# Altium project PHI_GATEWAY.PrjPcb (part 1 of 2)
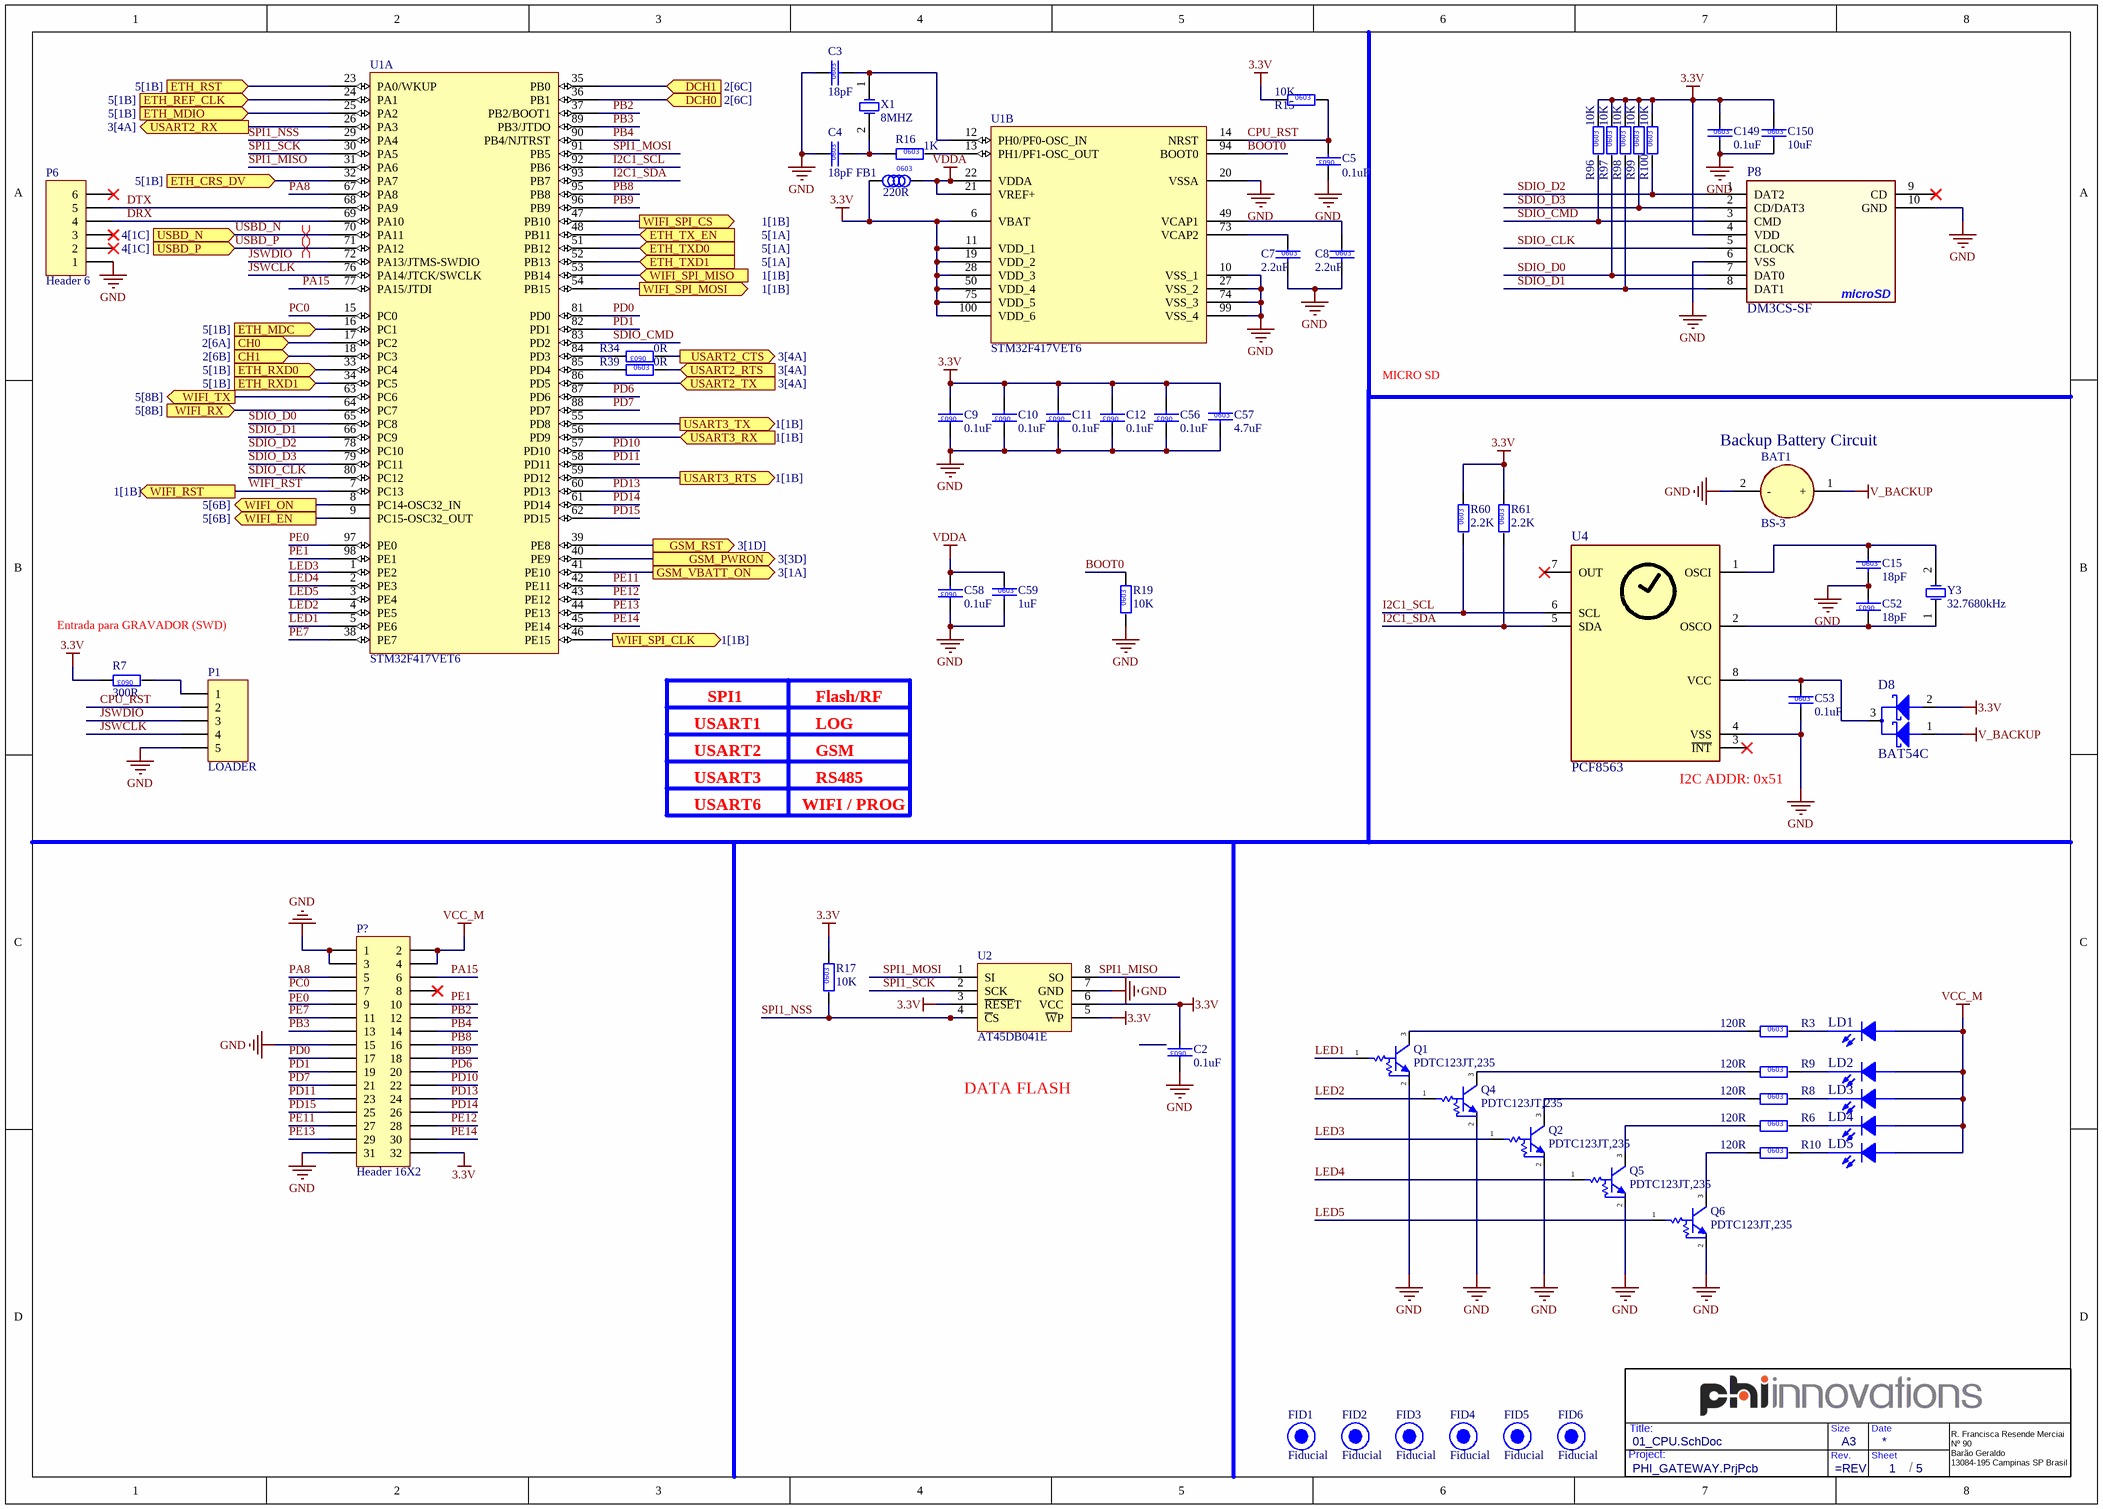
[diagram p0: 01_CPU.SchDoc]
6 sheets, 222 parts. Net scope: flat (ports and power ports of the same name join across sheets).
Board file: PHI_GATEWAY.PcbDoc
Sheets:
  01_CPU.SchDoc
  02_INPUTS.SchDoc
  03_GPRS.SchDoc
  04_POWER_USB.SchDoc
  05_ETHERNET.SchDoc
  VERSIONS.SchDoc

## Sheet 01_CPU.SchDoc
size A3; DocumentNumber: 1; SheetNumber: 1; SheetTotal: 5

### Parts
(Parts that share a designator on the sheet are numbered #1, #2 ... from top to bottom, then left to right.)
?#1  (no value)  (graphical)
BAT1  BS-3  [BAT_BS-3]
C2  0.1uF  [0603C]
C3  18pF  [0603C]
C4  18pF  [0603C]
C5  0.1uF  [0603C]
C7  2.2uF  [0603C]
C8  2.2uF  [0603C]
C9  0.1uF  [0603C]
C10  0.1uF  [0603C]
C11  0.1uF  [0603C]
C12  0.1uF  [0603C]
C15  18pF  [0603C]
C52  18pF  [0603C]
C53  0.1uF  [0603C]
C56  0.1uF  [0603C]
C57  4.7uF  [0603C]
C58  0.1uF  [0603C]
C59  1uF  [0603C]
C149  0.1uF  [0603C]
C150  10uF  [0603C]
D8  BAT54C  [SOT-23-3]
FB1  220R  [0603L]
FID1  Fiducial  [Fiducial Top]  (no BOM)
FID2  Fiducial  [Fiducial Top]  (no BOM)
FID3  Fiducial  [Fiducial Top]  (no BOM)
FID4  Fiducial  [Fiducial Top]  (no BOM)
FID5  Fiducial  [Fiducial Top]  (no BOM)
FID6  Fiducial  [Fiducial Top]  (no BOM)
LD1  LTST-S321KGKT  [LED_1208]  (value not drawn)
LD2  LTST-S321KGKT  [LED_1208]  (value not drawn)
LD3  LTST-S321KGKT  [LED_1208]  (value not drawn)
LD4  LTST-S321KGKT  [LED_1208]  (value not drawn)
LD5  LTST-S321KGKT  [LED_1208]  (value not drawn)
P1  LOADER  [HDR1X5]
P6  Header 6  [HDR1X6]
P8  DM3CS-SF  [CONN_DM3SC]
P?  Header 16X2  [HDR2X16]
Q1  PDTC123JT,235  [SOT-23-3]
Q2  PDTC123JT,235  [SOT-23-3]
Q4  PDTC123JT,235  [SOT-23-3]
Q5  PDTC123JT,235  [SOT-23-3]
Q6  PDTC123JT,235  [SOT-23-3]
R3  120R  [0603R]
R6  120R  [0603R]
R7  300R  [0603R]
R8  120R  [0603R]
R9  120R  [0603R]
R10  120R  [0603R]
R15  10K  [0603R]
R16  1K  [0603R]
R17  10K  [0603R]
R19  10K  [0603R]
R34  0R  [0603R]
R39  0R  [0603R]
R60  2.2K  [0603R]
R61  2.2K  [0603R]
R96  10K  [0603R]
R97  10K  [0603R]
R98  10K  [0603R]
R99  10K  [0603R]
R100  10K  [0603R]
U1  STM32F417VET6  [LQFP100]  (parts A,B of 2)
U2  AT45DB041E  [SOIC8]
U4  PCF8563  [SOIC8]
X1  8MHZ  [HC49]
Y3  32.7680kHz  [XTAL_32KHZ]

### Ports
CH0 (in, see 2[6A]), CH1 (in, see 2[6B]), DCH0 (in, see 2[6C]), DCH1 (in, see 2[6C]), ETH_CRS_DV (in, see 5[1B]), ETH_MDC (in, see 5[1B]), ETH_MDIO (in, see 5[1B]), ETH_REF_CLK (in, see 5[1B]), ETH_RST (in, see 5[1B]), ETH_RXD0 (in, see 5[1B]), ETH_RXD1 (in, see 5[1B]), ETH_TX_EN (in, see 5[1A]), ETH_TXD0 (in, see 5[1A]), ETH_TXD1 (in, see 5[1A]), GSM_PWRON (out, see 3[3D]), GSM_RST (out, see 3[1D]), GSM_VBATT_ON (out, see 3[1A]), USART2_CTS (out, see 3[4A]), USART2_RTS (in, see 3[4A]), USART2_RX (out, see 3[4A]), USART2_TX (in, see 3[4A]), USART3_RTS (out, see 1[1B]), USART3_RX (in, see 1[1B]), USART3_TX (out, see 1[1B]), USBD_N (in, see 4[1C]), USBD_P (in, see 4[1C]), WIFI_EN (out, see 5[6B]), WIFI_ON (out, see 5[6B]), WIFI_RST (out, see 1[1B]), WIFI_RX (in, see 5[8B]), WIFI_SPI_CLK (out, see 1[1B]), WIFI_SPI_CS (out, see 1[1B]), WIFI_SPI_MISO (in, see 1[1B]), WIFI_SPI_MOSI (out, see 1[1B]), WIFI_TX (out, see 5[8B])

### Nets
3.3V: C2.2 C9.2 C10.2 C11.2 C12.2 C56.2 C57.1 C149.1 C150.1 D8.2(ANODE2) FB1.1 P8.4(VDD) P?.32 R7.2 R15.1 R17.2 R60.2 R61.2 R96.2 R97.2 R98.2 R99.2 R100.2 U1.6(VBAT) U1.11(VDD_1) U1.19(VDD_2) U1.28(VDD_3) U1.50(VDD_4) U1.75(VDD_5) U1.100(VDD_6) U2.3(~{RESE}T) U2.5(~{W}P) U2.6(VCC)
GND: BAT1.2(-) C2.1 C3.1 C4.1 C5.1 C7.2 C8.2 C9.1 C10.1 C11.1 C12.1 C15.2 C52.2 C53.2 C56.1 C57.2 C58.1 C59.2 C149.2 C150.2 P1.5 P6.1 P8.6(VSS) P8.10(GND) P?.1 P?.3 P?.15 P?.31 Q1.2(E) Q2.2(E) Q4.2(E) Q5.2(E) Q6.2(E) R19.1 U1.10(VSS_1) U1.20(VSSA) U1.27(VSS_2) U1.74(VSS_3) U1.99(VSS_4) U2.7(GND) U4.4(VSS)
V_BACKUP: BAT1.1(+) D8.1(ANODE1)
VCC_M: LD1.A LD2.A LD3.A LD4.A LD5.A P?.2 P?.4
VDDA: C58.2 C59.1 FB1.2 U1.21(VREF+) U1.22(VDDA)
BOOT0: R19.2 U1.94(BOOT0)
CH0: U1.17(PC2) ; port CH0
CH1: U1.18(PC3) ; port CH1
CPU_RST: C5.2 P1.2 R15.2 U1.14(NRST)
DCH0: U1.36(PB1) ; port DCH0
DCH1: U1.35(PB0) ; port DCH1
DRX: P6.4 U1.69(PA10)
DTX: P6.5 U1.68(PA9)
ETH_CRS_DV: U1.32(PA7) ; port ETH_CRS_DV
ETH_MDC: U1.16(PC1) ; port ETH_MDC
ETH_MDIO: U1.25(PA2) ; port ETH_MDIO
ETH_REF_CLK: U1.24(PA1) ; port ETH_REF_CLK
ETH_RST: U1.23(PA0/WKUP) ; port ETH_RST
ETH_RXD0: U1.33(PC4) ; port ETH_RXD0
ETH_RXD1: U1.34(PC5) ; port ETH_RXD1
ETH_TX_EN: U1.48(PB11) ; port ETH_TX_EN
ETH_TXD0: U1.51(PB12) ; port ETH_TXD0
ETH_TXD1: U1.52(PB13) ; port ETH_TXD1
GSM_PWRON: U1.40(PE9) ; port GSM_PWRON
GSM_RST: U1.39(PE8) ; port GSM_RST
GSM_VBATT_ON: U1.41(PE10) ; port GSM_VBATT_ON
I2C1_SCL: R60.1 U1.92(PB6) U4.6(SCL)
I2C1_SDA: R61.1 U1.93(PB7) U4.5(SDA)
JSWCLK: P1.4 U1.76(PA14/JTCK/SWCLK)
JSWDIO: P1.3 U1.72(PA13/JTMS-SWDIO)
LED1: Q1.1(B) U1.5(PE6)
LED2: Q4.1(B) U1.4(PE5)
LED3: Q2.1(B)
LED4: Q5.1(B) U1.2(PE3)
LED5: Q6.1(B) U1.3(PE4)
PA8: P?.5 U1.67(PA8)
PA15: P?.6 U1.77(PA15/JTDI)
PB2: P?.12 U1.37(PB2/BOOT1)
PB3: P?.13 U1.89(PB3/JTDO)
PB4: P?.14 U1.90(PB4/NJTRST)
PB8: P?.16 U1.95(PB8)
PB9: P?.18 U1.96(PB9)
PC0: P?.7 U1.15(PC0)
PD0: P?.17 U1.81(PD0)
PD1: P?.19 U1.82(PD1)
PD6: P?.20 U1.87(PD6)
PD7: P?.21 U1.88(PD7)
PD10: P?.22 U1.57(PD10)
PD11: P?.23 U1.58(PD11)
PD13: P?.24 U1.60(PD13)
PD14: P?.26 U1.61(PD14)
PD15: P?.25 U1.62(PD15)
PE0: U1.97(PE0)
PE1: P?.10 U1.98(PE1)
PE7: P?.11 U1.38(PE7)
PE11: P?.27 U1.42(PE11)
PE12: P?.28 U1.43(PE12)
PE13: P?.29 U1.44(PE13)
PE14: P?.30 U1.45(PE14)
SDIO_CLK: P8.5(CLOCK) U1.80(PC12)
SDIO_CMD: P8.3(CMD) R96.1 U1.83(PD2)
SDIO_D0: P8.7(DAT0) R97.1 U1.65(PC8)
SDIO_D1: P8.8(DAT1) R98.1 U1.66(PC9)
SDIO_D2: P8.1(DAT2) R100.1 U1.78(PC10)
SDIO_D3: P8.2(CD/DAT3) R99.1 U1.79(PC11)
SPI1_MISO: U1.31(PA6) U2.8(SO)
SPI1_MOSI: U1.91(PB5) U2.1(SI)
SPI1_NSS: R17.1 U1.29(PA4) U2.4(~{C}S)
SPI1_SCK: U1.30(PA5) U2.2(SCK)
USART2_RX: U1.26(PA3) ; port USART2_RX
USART2_TX: U1.86(PD5) ; port USART2_TX
USBD_N: U1.70(PA11) ; port USBD_N
USBD_P: U1.71(PA12) ; port USBD_P
WIFI_EN: U1.9(PC15-OSC32_OUT) ; port WIFI_EN
WIFI_RST: U1.7(PC13) ; port WIFI_RST
WIFI_RX: U1.64(PC7) ; port WIFI_RX
WIFI_TX: U1.63(PC6) ; port WIFI_TX
NetC3_2: C3.2 U1.12(PH0/PF0-OSC_IN) X1.1(OSC1)
NetC4_2: C4.2 R16.1 X1.2(OSC2)
NetC7_1: C7.1 U1.73(VCAP2)
NetC8_1: C8.1 U1.49(VCAP1)
NetC15_1: C15.1 U4.1(OSCI) Y3.2(OSC2)
NetC52_1: C52.1 U4.2(OSCO) Y3.1(OSC1)
NetC53_1: C53.1 D8.3(CATHODE) U4.8(VCC)
NetLD1_K: LD1.K(C) R3.2
NetLD2_K: LD2.K(C) R9.2
NetLD3_K: LD3.K(C) R8.2
NetLD4_K: LD4.K(C) R6.2
NetLD5_K: LD5.K(C) R10.2
NetP1_1: P1.1 R7.1
NetQ1_3: Q1.3(C) R3.1
NetQ2_3: Q2.3(C) R8.1
NetQ4_3: Q4.3(C) R9.1
NetQ5_3: Q5.3(C) R6.1
NetQ6_3: Q6.3(C) R10.1
NetQ10_1: U1.8(PC14-OSC32_IN) ; port WIFI_ON
NetR16_2: R16.2 U1.13(PH1/PF1-OSC_OUT)
NetR34_1: R34.1 ; port USART2_CTS
NetR34_2: R34.2 U1.84(PD3)
NetR39_1: R39.1 U1.85(PD4)
NetR39_2: R39.2 ; port USART2_RTS
NetR87#2_1: U1.56(PD9) ; port USART3_RX
NetU1_46: U1.46(PE15) ; port WIFI_SPI_CLK
NetU1_47: U1.47(PB10) ; port WIFI_SPI_CS
NetU1_53: U1.53(PB14) ; port WIFI_SPI_MISO
NetU1_54: U1.54(PB15) ; port WIFI_SPI_MOSI
NetU1_55: U1.55(PD8) ; port USART3_TX
NetU1_59: U1.59(PD12) ; port USART3_RTS

Not connected (* = marked no-connect by the designer): P6 2* 3* 6*; P8 9(CD)*; P? 8* 9; U1 1(PE2); U4 3(~{INT})* 7(OUT)*

### Layout directives
differential pair: USBD_N, USBD_P

### Notes on the sheet
- MICRO SD
- (near BAT1) Backup Battery Circuit
- Entrada para GRAVADOR (SWD)
- SPI1
- Flash/RF
- USART1
- USART3
- USART2
- LOG
- GSM
- RS485
- (near U4) I2C ADDR: 0x51
- USART6
- WIFI / PROG
- DATA FLASH
- Labels drawn without touching a wire or pin: LED3, PE0
- Project:
- Title:
- Rev.
- Size
- Sheet
- Date
- /
- R. Francisca Resende Merciai
  Nº 90
  Barão Geraldo
  13084-195 Campinas SP Brasil
- (in symbol CAP0603) 0603
- (in symbol PHI100.0.0603.000R.001.1/10W) 0603
- (in symbol PHI100.0.0603.001K.001.1/10W) 0603
- (in symbol PHI100.0.0603.02K2.001.1/10W) 0603
- (in symbol PHI100.0.0603.120R.001.1/10W) 0603
- (in symbol PHI100.0.0603.300R.005.1/10W) 0603
- (in symbol PHI101.0.0603.010K.001.1/10W) 0603
- (in symbol PHI201.0.0603.000u1.005.050V.X7R) 0603
- (in symbol PHI201.0.0603.0001u.010.025V.X5R) 0603
- (in symbol PHI201.0.0603.002u2.010.025V.X5R) 0603
- (in symbol PHI201.0.0603.004u7.010.016V.X7R) 0603
- (in symbol PHI201.0.0603.0010u.010.016V.X5R) 0603
- (in symbol PHI201.0.0603.0018p.005.050V.C0G) 0603
- (in symbol PHI350.0.0603.0220R.XXX.0002A.050mOHM) 0603
- (in symbol PHI770.0.F.DM3CS-SF) microSD
- (in symbol RES0603) 0603

### Library data of the parts
?#1 = Title_Block3
BAT1 = PHI940.BS-3: HOLDER COINCELL 2032 RETAINR ARM; Fabricante 1: MPD; Partnumber PHI: PHI940.BS-3; Partnumber fabricante 1: BS-3; Datasheet fabricante 1: http://www.memoryprotectiondevices.com/datasheets/BS-3-datasheet.pdf; Distribuidor 1: Digi Key; PN distribuidor 1 / Fab 1: BS-3-ND; Distribuidor 2: Mouser; P Description: HOLDER COINCELL 2032 RETAINR ARM; Value: BS-3
C2 C5 C9-C12 C53 C56 C58 = PHI201.0.0603.000u1.005.050V.X7R: CAP0603; Partnumber fabricante 1: 06035C104JAT2A; Fabricante 1: AVX Corporation; P Description: Capacitor ceramico 0603 0.1uF 20% 50V X7R; SCH Info: GERAL; Datasheet fabricante 1: http://datasheets.avx.com/X7RDielectric.pdf; Distribuidor 1: Digi Key; Distribuidor 2: Mouser; Partnumber PHI: PHI201.0.0603.000u1.005.050V.X7R; PN distribuidor 1 / Fab 1: 478-5778-1-ND; Value: 0.1uF
C3 C4 = CAP0603: Part Number: CAP CER 18PF 50V NP0 0603; Partnumber fabricante 1: GRM1885C1H180JA01D; Partnumber PHI: PHI201.0.0603.0018p.005.050V.C0G; Fabricante 1: Murata Electronics North America; P Description: Capacitor ceramico 0603 18pF 5% 50V C0G; SCH Info: GERAL; Supplier 1: Digi-Key; Supplier Part Number 1: 478-1166-1-ND; Datasheet fabricante 1: http://www.murata.com/~/media/webrenewal/support/library/catalog/products/capacitor/mlcc/c02e.pdf; Distribuidor 1: Digi Key; Distribuidor 2: Mouser; PN distribuidor 1 / Fab 1: 490-1409-1-ND; Value: 18pF
C7 C8 = PHI201.0.0603.002u2.010.025V.X5R: CAP0603; Partnumber fabricante 1: GRM188R61E225MA12D; Fabricante 1: Murata Electronics North America; Fabricante 2: Samsung Electro-Mechanics America, Inc.; P Description: Capacitor ceramico 0603 1uF 5% 25V X5R; SCH Info: GERAL; Partnumber PHI: PHI201.0.0603.002u2.010.025V.X5R; Datasheet fabricante 1: http://www.murata.com/~/media/webrenewal/support/library/catalog/products/capacitor/mlcc/c02e.pdf; Partnumber fabricante 2: CL10A225KL8NNNC; Datasheet fabricante 2: http://www.samsungsem.com/kr/front/downloadcms.do?path=/kr/support/product-search/mlcc/__icsFiles/afieldfile/2014/11/05&fileName=C_CL10A105KA5LNNC.pdf; Distribuidor 1: Digi Key; PN distribuidor 1 / Fab 1: 490-12738-1-ND; PN distribuidor 1 / Fab 2: 1276-6726-1-ND; Distribuidor 2: Mouser; Value: 2.2uF
C15 C52 = PHI201.0.0603.0018p.005.050V.C0G: CAP0603; Partnumber fabricante 1: GRM1885C1H180JA01D; Fabricante 1: Murata Electronics North America; P Description: Capacitor ceramico 0603 18pF 5% 50V C0G; SCH Info: GERAL; Partnumber PHI: PHI201.0.0603.0018p.005.050V.C0G; Datasheet fabricante 1: http://www.murata.com/~/media/webrenewal/support/library/catalog/products/capacitor/mlcc/c02e.pdf; Distribuidor 1: Digi Key; PN distribuidor 1 / Fab 1: 490-1409-1-ND; Distribuidor 2: Mouser; Value: 18pF
C57 = PHI201.0.0603.004u7.010.016V.X7R: CAP0603; Partnumber fabricante 1: CL10A475KO8NNNC; Fabricante 1: Samsung Electro-Mechanics America, Inc; Fabricante 2: Taiyo Yuden; P Description: Capacitor ceramico 0603 4.7uF 10% 16V X7R; SCH Info: GERAL; Partnumber PHI: PHI201.0.0603.004u7.010.016V.X7R; Datasheet fabricante 1: http://www.samsungsem.com/kr/support/product-search/mlcc/CL10A475KO8NNNC.jsp; Partnumber fabricante 2: EMK107ABJ475KA-T; Datasheet fabricante 2: http://ds.yuden.co.jp/TYCOMPAS/ut/detail.do?productNo=EMK107ABJ475KA-T&fileName=EMK107ABJ475KA-T_SS&mode=specSheetDownload; Distribuidor 1: Digi Key; PN distribuidor 1 / Fab 1: 1276-1784-1-ND; PN distribuidor 1 / Fab 2: 587-2786-1-ND; Distribuidor 2: Mouser; Value: 4.7uF
C59 = PHI201.0.0603.0001u.010.025V.X5R: CAP0603; Partnumber fabricante 1: GRM188R61E105KA12D; Fabricante 1: Murata Electronics North America; Fabricante 2: Samsung Electro-Mechanics America, Inc.; P Description: Capacitor ceramico 0603 1uF 5% 25V X5R; SCH Info: GERAL; Partnumber PHI: PHI201.0.0603.0001u.010.025V.X5R; Datasheet fabricante 1: http://www.murata.com/~/media/webrenewal/support/library/catalog/products/capacitor/mlcc/c02e.pdf; Partnumber fabricante 2: CL10A105KA5LNNC; Datasheet fabricante 2: http://www.samsungsem.com/kr/front/downloadcms.do?path=/kr/support/product-search/mlcc/__icsFiles/afieldfile/2014/11/05&fileName=C_CL10A105KA5LNNC.pdf; Distribuidor 1: Digi Key; PN distribuidor 1 / Fab 1: 490-3897-1-ND; PN distribuidor 1 / Fab 2: 1276-1858-1-ND; Distribuidor 2: Mouser; Value: 1uF
C149 = PHI201.0.0603.000u1.005.050V.X7R: CAP0603; Partnumber fabricante 1: 06035C104JAT2A; Fabricante 1: AVX Corporation; P Description: Capacitor ceramico 0603 0.1uF 20% 50V X7R; Partnumber PHI: PHI201.0.0603.000u1.005.050V.X7R; Datasheet fabricante 1: http://datasheets.avx.com/X7RDielectric.pdf; Distribuidor 1: Digi Key; PN distribuidor 1 / Fab 1: 478-5778-1-ND; Distribuidor 2: Mouser; Value: 0.1uF
C150 = PHI201.0.0603.0010u.010.016V.X5R: Ceramic capacitor 10uF 16V X5R 10% 0603; Partnumber fabricante 1: GRM188R61C106KAALD; Fabricante 1: Murata Electronics North America; P Description: Capacitor ceramico 0603 10uF 5% 16V X7R; Partnumber PHI: PHI201.0.0603.0010u.010.016V.X5R; Datasheet fabricante 1: http://www.murata.com/~/media/webrenewal/support/library/catalog/products/capacitor/mlcc/c02e.pdf; Distribuidor 1: Digi Key; PN distribuidor 1 / Fab 1: 490-10728-1-ND; Distribuidor 2: Mouser; Value: 10uF
D8 = PHI420.0.BAT54C-7-F: BAT54C-7-F; Fabricante 1: Diodes Incorporated; P Description: Diodo Array Schottky Small Sig SOT-23-3 30V 1 Pair Common Cathode; SCH Info: GERAL; Partnumber PHI: PHI420.0.BAT54C-7-F; Partnumber fabricante 1: BAT54C-7-F; Datasheet fabricante 1: http://www.diodes.com/_files/datasheets/ds11005.pdf; Distribuidor 1: Digi Key; PN distribuidor 1 / Fab 1: BAT54C-FDICT-ND; Distribuidor 2: Mouser; Value: BAT54C
FB1 = PHI350.0.0603.0220R.XXX.0002A.050mOHM: FB0603; Partnumber fabricante 1: BLM18EG221SN1D; Fabricante 1: Murata Electronics North America; P Description: Ferrite Bead Chip 0603 220OHM 2A 50mOHM; SCH Info: GERAL; Partnumber PHI: PHI350.0.0603.0220R.XXX.0002A.050mOHM; Datasheet fabricante 1: http://search.murata.co.jp/Ceramy/image/img/PDF/ENG/L0110S0101BLM18E.pdf; Distribuidor 1: Digi Key; PN distribuidor 1 / Fab 1: 490-3992-1-ND; Distribuidor 2: Mouser; Value: 220R
FID1-FID6 = Fiducial: PCB Info: DNP
LD1-LD5 = LED: Fabricante 1: Lite-On; P Description: Standard LEDs - SMD Green 571nm 35mcd Clear; SCH Info: GERAL; Partnumber fabricante 1: LTST-S321KGKT; Value: LTST-S321KGKT
P1 = Header 5: HEADER MALE 5-Pin 2.54MM PITCH; Part Number: HEADER MALE 5x1Pin 2.54MM PITCH; Partnumber fabricante 1: Header 2.54mm; SCH Info: GERAL; Supplier 1: Digi-Key
P6 = Header 6: Header, 6-Pin; Partnumber fabricante 1: Header 2.54mm; SCH Info: GERAL
P8 = PHI770.0.F.DM3CS-SF: microSD_CONN_8; Fabricante 1: Hirose Electric Co Ltd; P Description: CONN MICRO SD CARD HINGED TYPE; Partnumber PHI: PHI770.0.F.DM3CS-SF; Partnumber fabricante 1: DM3CS-SF; Datasheet fabricante 1: https://www.hirose.com/product/en/download_file/key_name/DM3/category/Catalog/doc_file_id/49662/?file_category_id=4&item_id=195&is_series=1; Distribuidor 1: Digi Key; PN distribuidor 1 / Fab 1: HR1972CT-ND; Value: DM3CS-SF
P? = Header 16X2: Header, 16-Pin, Dual row; LatestRevisionDate: 17-Jul-2002; LatestRevisionNote: Re-released for DXP Platform.; Publisher: Altium Limited
Q1 Q2 Q4-Q6 = PHI530.0.PDTC123JT,235: BJT_PB_NPN_SOT23-3; Fabricante 1: NXP Semiconductors; P Description: TRANS PREBIAS NPN 250MW TO236AB; SCH Info: GERAL; Partnumber PHI: PHI530.0.PDTC123JT,235; Partnumber fabricante 1: PDTC123JT,235; Datasheet fabricante 1: http://www.nxp.com/documents/data_sheet/PDTC123J_SER.pdf; Distribuidor 1: Digi Key; PN distribuidor 1 / Fab 1: 568-2154-1-ND; Distribuidor 2: Mouser; Value: PDTC123JT,235
R3 R6 R8-R10 = PHI100.0.0603.120R.001.1/10W: RES0603; Partnumber fabricante 1: RC0603FR-07120RL; Fabricante 1: Yageo; P Description: Resistor SMD 0603 120R 1% 1/16W; SCH Info: GERAL; Partnumber PHI: PHI100.0.0603.120R.001.1/10W; Datasheet fabricante 1: http://www.yageo.com.tw/exep/pages/download/literatures/PYu-R_INT-thick_7.pdf; Distribuidor 1: Digi Key; PN distribuidor 1 / Fab 1: 311-120HRCT-ND; Distribuidor 2: Mouser; Value: 120R
R7 = PHI100.0.0603.300R.005.1/10W: RES0603; Partnumber fabricante 1: RC0603JR-07300RL; Fabricante 1: Yageo; P Description: Resistor SMD 0603 300R 5% 1/10W; SCH Info: MODBUS; Partnumber PHI: PHI100.0.0603.300R.005.1/10W; Datasheet fabricante 1: http://www.yageo.com.tw/exep/pages/download/literatures/PYu-R_INT-thick_7.pdf; Distribuidor 1: Digi Key; PN distribuidor 1 / Fab 1: 311-300GRTR-ND; Value: 300R
R15 R19 = PHI101.0.0603.010K.001.1/10W: RES0603; Partnumber fabricante 1: RC0603FR-0710KL; Fabricante 1: Yageo; Fabricante 2: Stackpole Electronics Inc; P Description: Resistor SMD 0603 10K 1% 1/08W; SCH Info: GERAL; Partnumber PHI: PHI101.0.0603.010K.001.1/10W; Datasheet fabricante 1: http://www.yageo.com/documents/recent/PYu-RC_Group_51_RoHS_L_04.pdf; Partnumber fabricante 2: RNCP0603FTD10K0; Datasheet fabricante 2: http://www.seielect.com/catalog/SEI-RNCP.pdf; Distribuidor 1: Digi Key; PN distribuidor 1 / Fab 1: 311-10.0KHRCT-ND; PN distribuidor 1 / Fab 2: RMCF0603FT10K0CT-ND; Distribuidor 2: Mouser; Value: 10K
R16 = PHI100.0.0603.001K.001.1/10W: RES0603; Partnumber fabricante 1: RC0603FR-071KL; Fabricante 1: Yageo; Fabricante 2: Panasonic Electronic Components; P Description: Resistor SMD 0603 1K 1% 1/10W; SCH Info: GERAL; Partnumber PHI: PHI100.0.0603.001K.001.1/10W; Datasheet fabricante 1: http://www.yageo.com/NewPortal/yageodocoutput?fileName=/pdf/R-Chip/PYu-RC_Group_51_RoHS_L_3.pdf; Partnumber fabricante 2: ERJ-3EKF1001V; Datasheet fabricante 2: http://industrial.panasonic.com/www-cgi/jvcr13pz.cgi?E+PZ+3+AOA0002+ERJ3EKF1001V+7+WW; Distribuidor 1: Digi Key; PN distribuidor 1 / Fab 1: 311-1.00KHRCT-ND; PN distribuidor 1 / Fab 2: P1.00KHCT-ND; Distribuidor 2: Mouser; Value: 1K
R17 = RES0603: Part Number: RES_0603_1%_10k; Partnumber fabricante 1: RC0603FR-0710KL; Partnumber PHI: PHI101.0.0603.010K.001.1/10W; Fabricante 1: Yageo; P Description: Resistor SMD 0603 10K 1% 1/08W; Fabricante 2: Stackpole Electronics Inc; SCH Info: GERAL; Supplier 1: Digi-Key; Supplier Part Number 1: 311-10.0KHRCT-ND; Datasheet fabricante 1: http://www.yageo.com/documents/recent/PYu-RC_Group_51_RoHS_L_04.pdf; Distribuidor 1: Digi Key; Distribuidor 2: Mouser; PN distribuidor 1 / Fab 1: 311-10.0KHRCT-ND; Value: 10K; Datasheet fabricante 2: http://www.seielect.com/catalog/SEI-RNCP.pdf; Partnumber fabricante 2: RNCP0603FTD10K0; PN distribuidor 1 / Fab 2: RMCF0603FT10K0CT-ND
R34 R39 = PHI100.0.0603.000R.001.1/10W: RES0603; Partnumber fabricante 1: RC0603JR-070RL; Fabricante 1: Yageo; Fabricante 2: Panasonic Electronic Components; P Description: Resistor SMD 0603 0R JUMPER 1/10W; SCH Info: GERAL; Partnumber PHI: PHI100.0.0603.000R.001.1/10W; Datasheet fabricante 1: http://www.yageo.com/NewPortal/yageodocoutput?fileName=/pdf/R-Chip/PYu-RC_Group_51_RoHS_L_3.pdf; Partnumber fabricante 2: ERJ-3GEY0R00V; Datasheet fabricante 2: http://industrial.panasonic.com/www-cgi/jvcr13pz.cgi?E+PZ+3+AOA0001+ERJ3GEY0R00V+7+WW; Distribuidor 1: Digi Key; PN distribuidor 1 / Fab 1: 311-0.0GRCT-ND; PN distribuidor 1 / Fab 2: P0.0GTR-ND; Distribuidor 2: Mouser; Value: 0R
R60 R61 = PHI100.0.0603.02K2.001.1/10W: RES0603; Partnumber fabricante 1: RC0603FR-072K2L; Fabricante 1: Yageo; Fabricante 2: Stackpole Electronics Inc; P Description: Resistor SMD 0603 2.2K 1% 1/10W; SCH Info: GERAL; Partnumber PHI: PHI100.0.0603.02K2.001.1/10W; Datasheet fabricante 1: http://www.yageo.com/NewPortal/yageodocoutput?fileName=/pdf/R-Chip/PYu-RC_Group_51_RoHS_L_3.pdf; Partnumber fabricante 2: RMCF0603FT2K20; Datasheet fabricante 2: http://www.seielect.com/Catalog/SEI-RMCF_RMCP.pdf; Distribuidor 1: Digi Key; PN distribuidor 1 / Fab 1: 311-2.20KHRCT-ND; PN distribuidor 1 / Fab 2: RMCF0603FT2K20CT-ND; Distribuidor 2: Mouser; Value: 2.2K
R96-R99 = PHI101.0.0603.010K.001.1/10W: RES0603; Partnumber fabricante 1: RC0603FR-0710KL; Fabricante 1: Yageo; Fabricante 2: Stackpole Electronics Inc; P Description: Resistor SMD 0603 10K 1% 1/08W; Partnumber PHI: PHI101.0.0603.010K.001.1/10W; Datasheet fabricante 1: http://www.yageo.com/documents/recent/PYu-RC_Group_51_RoHS_L_04.pdf; Partnumber fabricante 2: RNCP0603FTD10K0; Datasheet fabricante 2: http://www.seielect.com/catalog/SEI-RNCP.pdf; Distribuidor 1: Digi Key; PN distribuidor 1 / Fab 1: 311-10.0KHRCT-ND; PN distribuidor 1 / Fab 2: RMCF0603FT10K0CT-ND; Distribuidor 2: Mouser; Value: 10K
R100 = PHI101.0.0603.010K.001.1/10W: RES0603; Partnumber fabricante 1: MCT06030C1002FP500; Fabricante 1: Vishay Beyschlag; Fabricante 2: Stackpole Electronics Inc; P Description: Resistor SMD 0603 10K 1% 1/08W; Partnumber PHI: PHI101.0.0603.010K.001.1/10W; Datasheet fabricante 1: http://www.vishay.com/docs/28705/mcx0x0xpro.pdf; Partnumber fabricante 2: RNCP0603FTD10K0; Datasheet fabricante 2: http://www.seielect.com/catalog/SEI-RNCP.pdf; Distribuidor 1: Digi Key; PN distribuidor 1 / Fab 1: MCT0603-10.0K-CFCT-ND; Distribuidor 2: Mouser; Value: 10K
U1 = PHI800.0.STM32F417VET6: Fabricante 1: STMicroelectronics; P Description: IC MCU 32BIT 512KB FLASH 100LQFP; Partnumber PHI: PHI800.0.STM32F417VET6; Partnumber fabricante 1: STM32F417VET6; Datasheet fabricante 1: http://www.st.com/content/ccc/resource/technical/document/datasheet/98/9f/89/73/01/b1/48/98/DM00035129.pdf/files/DM00035129.pdf/jcr:content/translations/en.DM00035129.pdf; Distribuidor 1: Digi Key; PN distribuidor 1 / Fab 1: 497-11901-ND; Distribuidor 2: Mouser; Value: STM32F417VET6
U2 = PHI800.0.MX25L8006EM1I-12G: IC FLASH 8MBIT 86MHZ 8SOP; Manufacturer: Micron Technology Inc.; Part Number: M25P80-VMN6TP; Fabricante 1: Macronix; Value: AT25128B; SCH Info: GERAL; Supplier 1: Digi-Key; Supplier Part Number 1: M25P80-VMN6TPCT-ND; Partnumber PHI: PHI800.0.MX25L8006EM1I-12G; Partnumber fabricante 1: MX25L8006EM1I-12G; Datasheet fabricante 1: http://www.macronix.com/Lists/Datasheet/Attachments/5088/MX25L8006E,%203V,%208Mb,%20v1.5.pdf; Distribuidor 1: Digi Key; PN distribuidor 1 / Fab 1: 1092-1117-ND; Distribuidor 2: Mouser; P Description: IC FLASH 8MBIT 86MHZ 8SOP
U4 = PHI800.0.PCF8563T/5,518: IC RTC CLK/CALENDAR I2C 8SOIC; Manufacturer Name: ST; Part Number: PCF85063AT/AY; Fabricante 1: NXP; P Description: IC RTC CLK/CALENDAR I2C 8-SOIC; SCH Info: GERAL; Partnumber PHI: PHI800.0.PCF8563T/5,518; Partnumber fabricante 1: PCF8563T/5,518; Datasheet fabricante 1: http://www.nxp.com/docs/en/data-sheet/PCF8563.pdf; Distribuidor 1: Digi Key; PN distribuidor 1 / Fab 1: 568-6650-1-ND; Distribuidor 2: Mouser; Value: PCF8563
X1 = PHI600.0.ATS08ASM-1: XTAL_HC49; Fabricante 1: CTS-Frequency Controls; P Description: CRYSTAL 8.0000MHZ 20PF SMD; Partnumber PHI: PHI600.0.ATS08ASM-1; Partnumber fabricante 1: ATS08ASM-1; Datasheet fabricante 1: https://www.ctscorp.com/wp-content/uploads/ATS-ATSSM.pdf; Distribuidor 1: Digi Key; PN distribuidor 1 / Fab 1: CTX506CT-ND; Distribuidor 2: Mouser; Value: 8MHZ
Y3 = PHI600.0.AB38T-32.768KHZ-12.5: XTAL_HC49; Fabricante 1: Abracon LLC; P Description: Cristal 12.5pF ±20ppm 32.7680KHZ; Partnumber PHI: PHI600.0.AB38T-32.768KHZ-12.5; Partnumber fabricante 1: AB38T-32.768KHZ-12.5; Datasheet fabricante 1: http://www.abracon.com/Resonators/AB38T.pdf; Distribuidor 1: Digi Key; Distribuidor 2: Mouser; Value: 32.7680kHz

## Sheet 02_INPUTS.SchDoc
size A3; DocumentNumber: 2; SheetNumber: 2; SheetTotal: 5
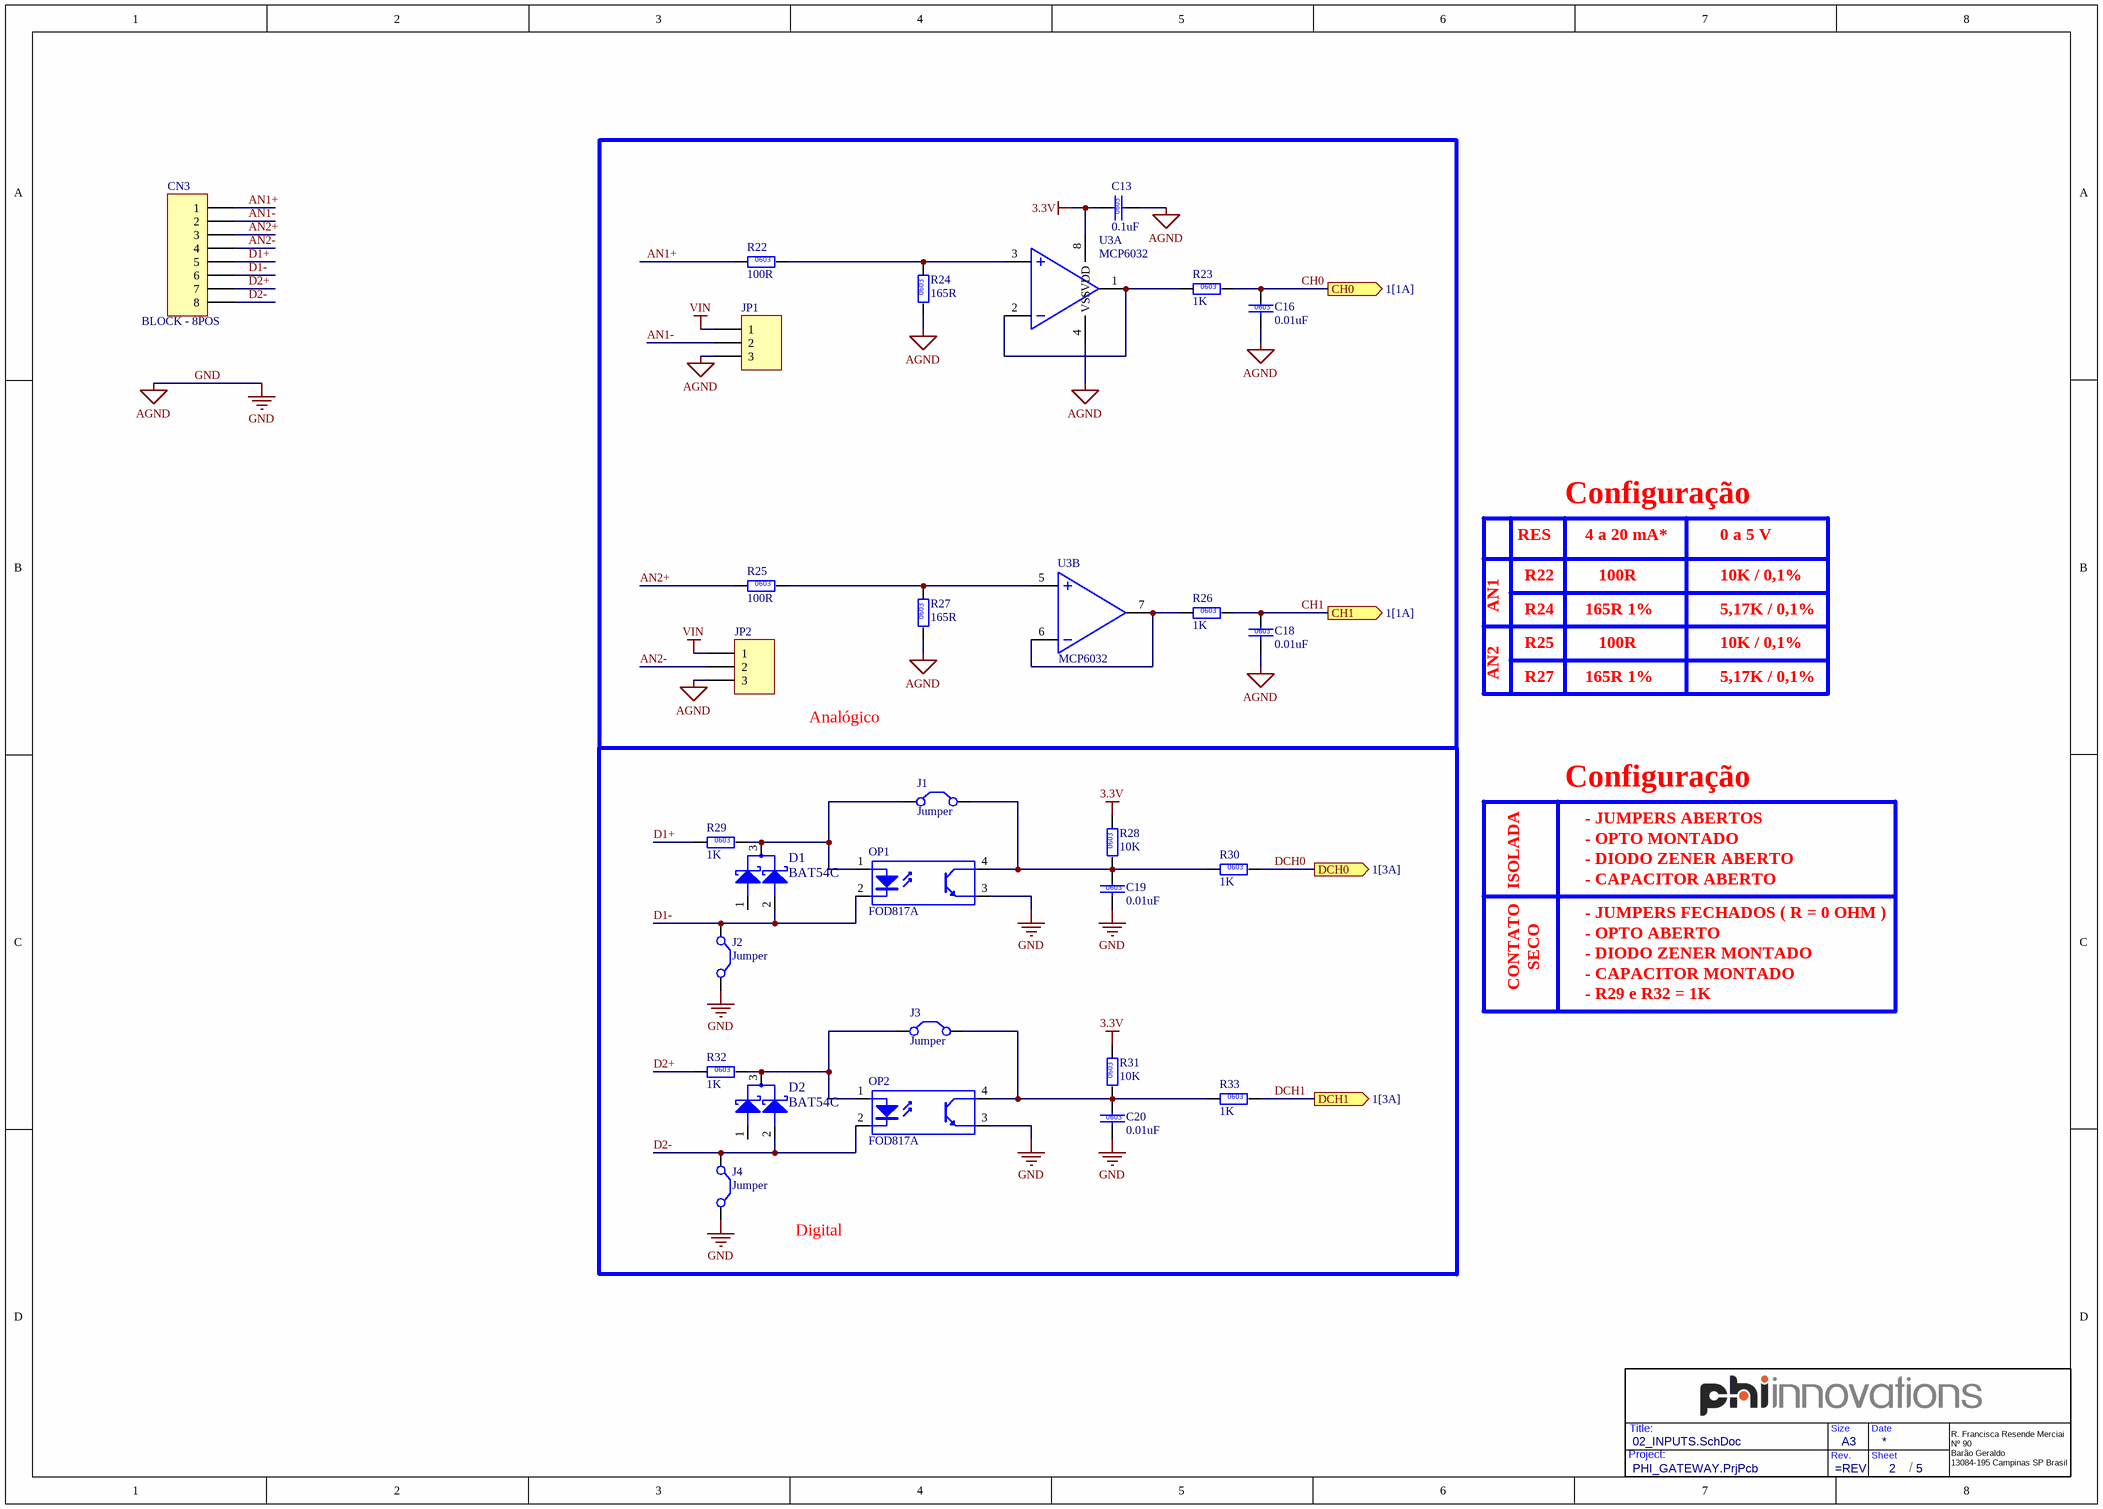
[diagram p1: 02_INPUTS.SchDoc]

### Parts
(Parts that share a designator on the sheet are numbered #1, #2 ... from top to bottom, then left to right.)
?#2  (no value)  (graphical)
C13  0.1uF  [0603C]
C16  0.01uF  [0603C]
C18  0.01uF  [0603C]
C19  0.01uF  [0603C]
C20  0.01uF  [0603C]
CN3  BLOCK - 8POS  [CONN_BORNE_3.81_8POS]
D1  BAT54C  [SOT-23-3]
D2  BAT54C  [SOT-23-3]
J1  Jumper  [HDR1X2]
J2  Jumper  [HDR1X2]
J3  Jumper  [HDR1X2]
J4  Jumper  [HDR1X2]
JP1  (no value)  [HDR1X3]
JP2  (no value)  [HDR1X3]
OP1  FOD817A  [OP SMD]
OP2  FOD817A  [OP SMD]
R22  100R  [0603R]
R23  1K  [0603R]
R24  165R  [0603R]
R25  100R  [0603R]
R26  1K  [0603R]
R27  165R  [0603R]
R28  10K  [0603R]
R29  1K  [0603R]
R30  1K  [0603R]
R31  10K  [0603R]
R32  1K  [0603R]
R33  1K  [0603R]
U3  MCP6032  [SOIC8]  (parts A,B of 2)

### Blocks framed on the sheet
Analógico: C13 C16 C18 JP1 JP2 R22-R27 U3
Digital: C19 C20 D1 D2 J1-J4 OP1 OP2 R28-R33

### Ports
CH0 (out, see 1[1A]), CH1 (out, see 1[1A]), DCH0 (out, see 1[3A]), DCH1 (out, see 1[3A])

### Nets
3.3V: C13.1 R28.2 R31.2 U3.8(VDD)
GND: C13.2 C16.2 C18.2 C19.2 C20.2 J2.2(C2) J4.2(C2) JP1.3 JP2.3 OP1.3(E) OP2.3(E) R24.1 R27.1 U3.4(VSS)  [also labelled AGND]
VIN: JP1.1 JP2.1
AN1+: CN3.1 R22.1
AN1-: CN3.2 JP1.2
AN2+: CN3.3 R25.1
AN2-: CN3.4 JP2.2
CH0: C16.1 R23.2 ; port CH0
CH1: C18.1 R26.2 ; port CH1
D1+: CN3.5 R29.1
D1-: CN3.6 D1.2(ANODE2) J2.1(C1) OP1.2(K)
D2+: CN3.7 R32.1
D2-: CN3.8 D2.2(ANODE2) J4.1(C1) OP2.2(K)
DCH0: R30.2 ; port DCH0
DCH1: R33.2 ; port DCH1
NetC19_1: C19.1 J1.2(C2) OP1.4(C) R28.1 R30.1
NetC20_1: C20.1 J3.2(C2) OP2.4(C) R31.1 R33.1
NetD1_3: D1.3(CATHODE) J1.1(C1) OP1.1(A) R29.2
NetD2_3: D2.3(CATHODE) J3.1(C1) OP2.1(A) R32.2
NetR22_2: R22.2 R24.2 U3.3(VINA+)
NetR23_1: R23.1 U3.1(VOUTA) U3.2(VINA-)
NetR25_2: R25.2 R27.2 U3.5(VINB+)
NetR26_1: R26.1 U3.6(VINB-) U3.7(VOUTB)

Not connected (* = marked no-connect by the designer): D1 1(ANODE1); D2 1(ANODE1)

### Notes on the sheet
- Configuração
- RES
- R22
- 4 a 20 mA*
- 100R
- 0 a 5 V
- 10K / 0,1%
- AN1
- R24
- R25
- 165R 1%
- 5,17K / 0,1%
- AN2
- R27
- - JUMPERS ABERTOS
- - OPTO MONTADO
- ISOLADA
- - DIODO ZENER ABERTO
- - CAPACITOR ABERTO
- - JUMPERS FECHADOS ( R = 0 OHM )
- CONTATO
- SECO
- - OPTO ABERTO
- - DIODO ZENER MONTADO
- - CAPACITOR MONTADO
- - R29 e R32 = 1K
- Project:
- Title:
- Rev.
- Size
- Sheet
- Date
- /
- R. Francisca Resende Merciai
  Nº 90
  Barão Geraldo
  13084-195 Campinas SP Brasil
- (in symbol PHI100.0.0603.100R.001.1/10W) 0603
- (in symbol PHI100.0.0603.165R.001.1/10W) 0603
- (in symbol PHI201.0.0603.000u1.005.050V.X7R) 0603
- (in symbol PHI201.0.0603.00u01.010.050V.X7R) 0603
- (in symbol RES0603) 0603

### Library data of the parts
?#2 = Title_Block3
C13 = PHI201.0.0603.000u1.005.050V.X7R: CAP0603; Partnumber fabricante 1: 06035C104JAT2A; Fabricante 1: AVX Corporation; P Description: Capacitor ceramico 0603 0.1uF 20% 50V X7R; SCH Info: IOs; Datasheet fabricante 1: http://datasheets.avx.com/X7RDielectric.pdf; Distribuidor 1: Digi Key; Distribuidor 2: Mouser; Partnumber PHI: PHI201.0.0603.000u1.005.050V.X7R; PN distribuidor 1 / Fab 1: 478-5778-1-ND; Value: 0.1uF
C16 C18-C20 = PHI201.0.0603.00u01.010.050V.X7R: CAP0603; Partnumber fabricante 1: C0603C103K5RACTU; Fabricante 1: Kemet; P Description: Capacitor ceramico 0603 10000pF 10% 50V X7R; SCH Info: IOs; Partnumber PHI: PHI201.0.0603.00u01.010.050V.X7R; Datasheet fabricante 1: http://www.kemet.com/docfinder?Partnumber=C0603C103K5RACTU; Distribuidor 1: Digi Key; PN distribuidor 1 / Fab 1: 399-1091-1-ND; Distribuidor 2: Mouser; Value: 0.01uF
CN3 = PHI740.1.M.OSTOQ083251: HEADER_8; Fabricante 1: On Shore Technology Inc.; P Description: TERM BLOCK HDR 8POS 90DEG 3.81MM; SCH Info: IOs; Partnumber PHI: PHI740.1.M.OSTOQ083251; Partnumber fabricante 1: OSTOQ083251; Datasheet fabricante 1: http://www.on-shore.com/wp-content/uploads/2015/09/ostoqxx3251.pdf; Distribuidor 1: Digi Key; PN distribuidor 1 / Fab 1: ED2814-ND; Distribuidor 2: Mouser; Value: BLOCK - 8POS
D1 D2 = PHI420.0.BAT54C-7-F: BAT54C-7-F; Fabricante 1: Diodes Incorporated; P Description: Diodo Array Schottky Small Sig SOT-23-3 30V 1 Pair Common Cathode; SCH Info: IOs; Partnumber PHI: PHI420.0.BAT54C-7-F; Partnumber fabricante 1: BAT54C-7-F; Datasheet fabricante 1: http://www.diodes.com/_files/datasheets/ds11005.pdf; Distribuidor 1: Digi Key; PN distribuidor 1 / Fab 1: BAT54C-FDICT-ND; Distribuidor 2: Mouser; Value: BAT54C
J1-J4 = Jumper: Jumper Wire; Partnumber fabricante 1: Header 2.54mm; SCH Info: IOs
JP1 JP2 = Header 3: Header, 3-Pin; Partnumber fabricante 1: Header 2.54mm; SCH Info: IOs
OP1 OP2 = PHI800.0.FOD817A3SD: OPTOISOLATOR 5KV TRANSISTOR 4SMD; Fabricante 1: Fairchild Semiconductor; SCH Info: IOs; Partnumber PHI: PHI800.0.FOD817A3SD; Partnumber fabricante 1: FOD817A3SD; Datasheet fabricante 1: http://www.fairchildsemi.com/datasheets/FO/FOD817A.pdf; Distribuidor 1: Digi Key; PN distribuidor 1 / Fab 1: FOD817A3SDCT-ND; Distribuidor 2: Mouser; P Description: OPTOISOLATOR 5KV TRANSISTOR 4SMD; Value: FOD817A
R22 R25 = PHI100.0.0603.100R.001.1/10W: RES0603; Partnumber fabricante 1: RC0603FR-07100RL; Fabricante 1: Yageo; P Description: Resistor SMD 0603 100R 1% 1/16W; Partnumber PHI: PHI100.0.0603.100R.001.1/10W; Datasheet fabricante 1: http://www.yageo.com.tw/exep/pages/download/literatures/PYu-R_INT-thick_7.pdf; Distribuidor 1: Digi Key; PN distribuidor 1 / Fab 1: 311-100HRCT-ND; Distribuidor 2: Mouser; Value: 100R
R23 R26 R29 R30 R32 R33 = RES0603: Resistor 0603 1K; Part Number: RES_0603_1%_1K; Partnumber fabricante 1: RC0603FR-071KL; Partnumber PHI: PHI100.0.0603.001K.001.1/10W; Fabricante 1: Yageo; P Description: Resistor SMD 0603 1K 1% 1/10W; Fabricante 2: Panasonic Electronic Components; SCH Info: IOs; Supplier 1: Digi-Key; Supplier Part Number 1: 311-1.00KHRCT-ND; Datasheet fabricante 1: http://www.yageo.com/NewPortal/yageodocoutput?fileName=/pdf/R-Chip/PYu-RC_Group_51_RoHS_L_3.pdf; Distribuidor 1: Digi Key; Distribuidor 2: Mouser; PN distribuidor 1 / Fab 1: 311-1.00KHRCT-ND; Value: 1K; Datasheet fabricante 2: http://industrial.panasonic.com/www-cgi/jvcr13pz.cgi?E+PZ+3+AOA0002+ERJ3EKF1001V+7+WW; Partnumber fabricante 2: ERJ-3EKF1001V; PN distribuidor 1 / Fab 2: P1.00KHCT-ND
R24 R27 = PHI100.0.0603.165R.001.1/10W: RES0603; Partnumber fabricante 1: RC0603FR-07165RL; Fabricante 1: Yageo; P Description: Resistor SMD 0603 165R 1% 1/16W; Partnumber PHI: PHI100.0.0603.165R.001.1/10W; Datasheet fabricante 1: http://www.yageo.com.tw/exep/pages/download/literatures/PYu-R_INT-thick_7.pdf; Distribuidor 1: Digi Key; PN distribuidor 1 / Fab 1: 311-165HRCT-ND; Distribuidor 2: Mouser; Value: 165R
R28 R31 = RES0603: Part Number: RES_0603_1%_10k; Partnumber fabricante 1: RC0603FR-0710KL; Partnumber PHI: PHI101.0.0603.010K.001.1/10W; Fabricante 1: Yageo; P Description: Resistor SMD 0603 10K 1% 1/08W; Fabricante 2: Stackpole Electronics Inc; SCH Info: IOs; Supplier 1: Digi-Key; Supplier Part Number 1: 311-10.0KHRCT-ND; Datasheet fabricante 1: http://www.yageo.com/documents/recent/PYu-RC_Group_51_RoHS_L_04.pdf; Distribuidor 1: Digi Key; Distribuidor 2: Mouser; PN distribuidor 1 / Fab 1: 311-10.0KHRCT-ND; Value: 10K; Datasheet fabricante 2: http://www.seielect.com/catalog/SEI-RNCP.pdf; Partnumber fabricante 2: RNCP0603FTD10K0; PN distribuidor 1 / Fab 2: RMCF0603FT10K0CT-ND
U3 = PHI800.0.MCP6032-E/SN: Fabricante 1: Microchip Technology; P Description: IC OPAMP GP 10KHZ RRO 8SOIC; Partnumber PHI: PHI800.0.MCP6032-E/SN; Partnumber fabricante 1: MCP6032-E/SN; Datasheet fabricante 1: http://www.microchip.com/mymicrochip/filehandler.aspx?ddocname=en528763; Distribuidor 1: Digi Key; PN distribuidor 1 / Fab 1: MCP6032-E/SN-ND; Distribuidor 2: Mouser; Value: MCP6032

## Sheet 03_GPRS.SchDoc
size A3; DocumentNumber: 3; SheetNumber: 3; SheetTotal: 5
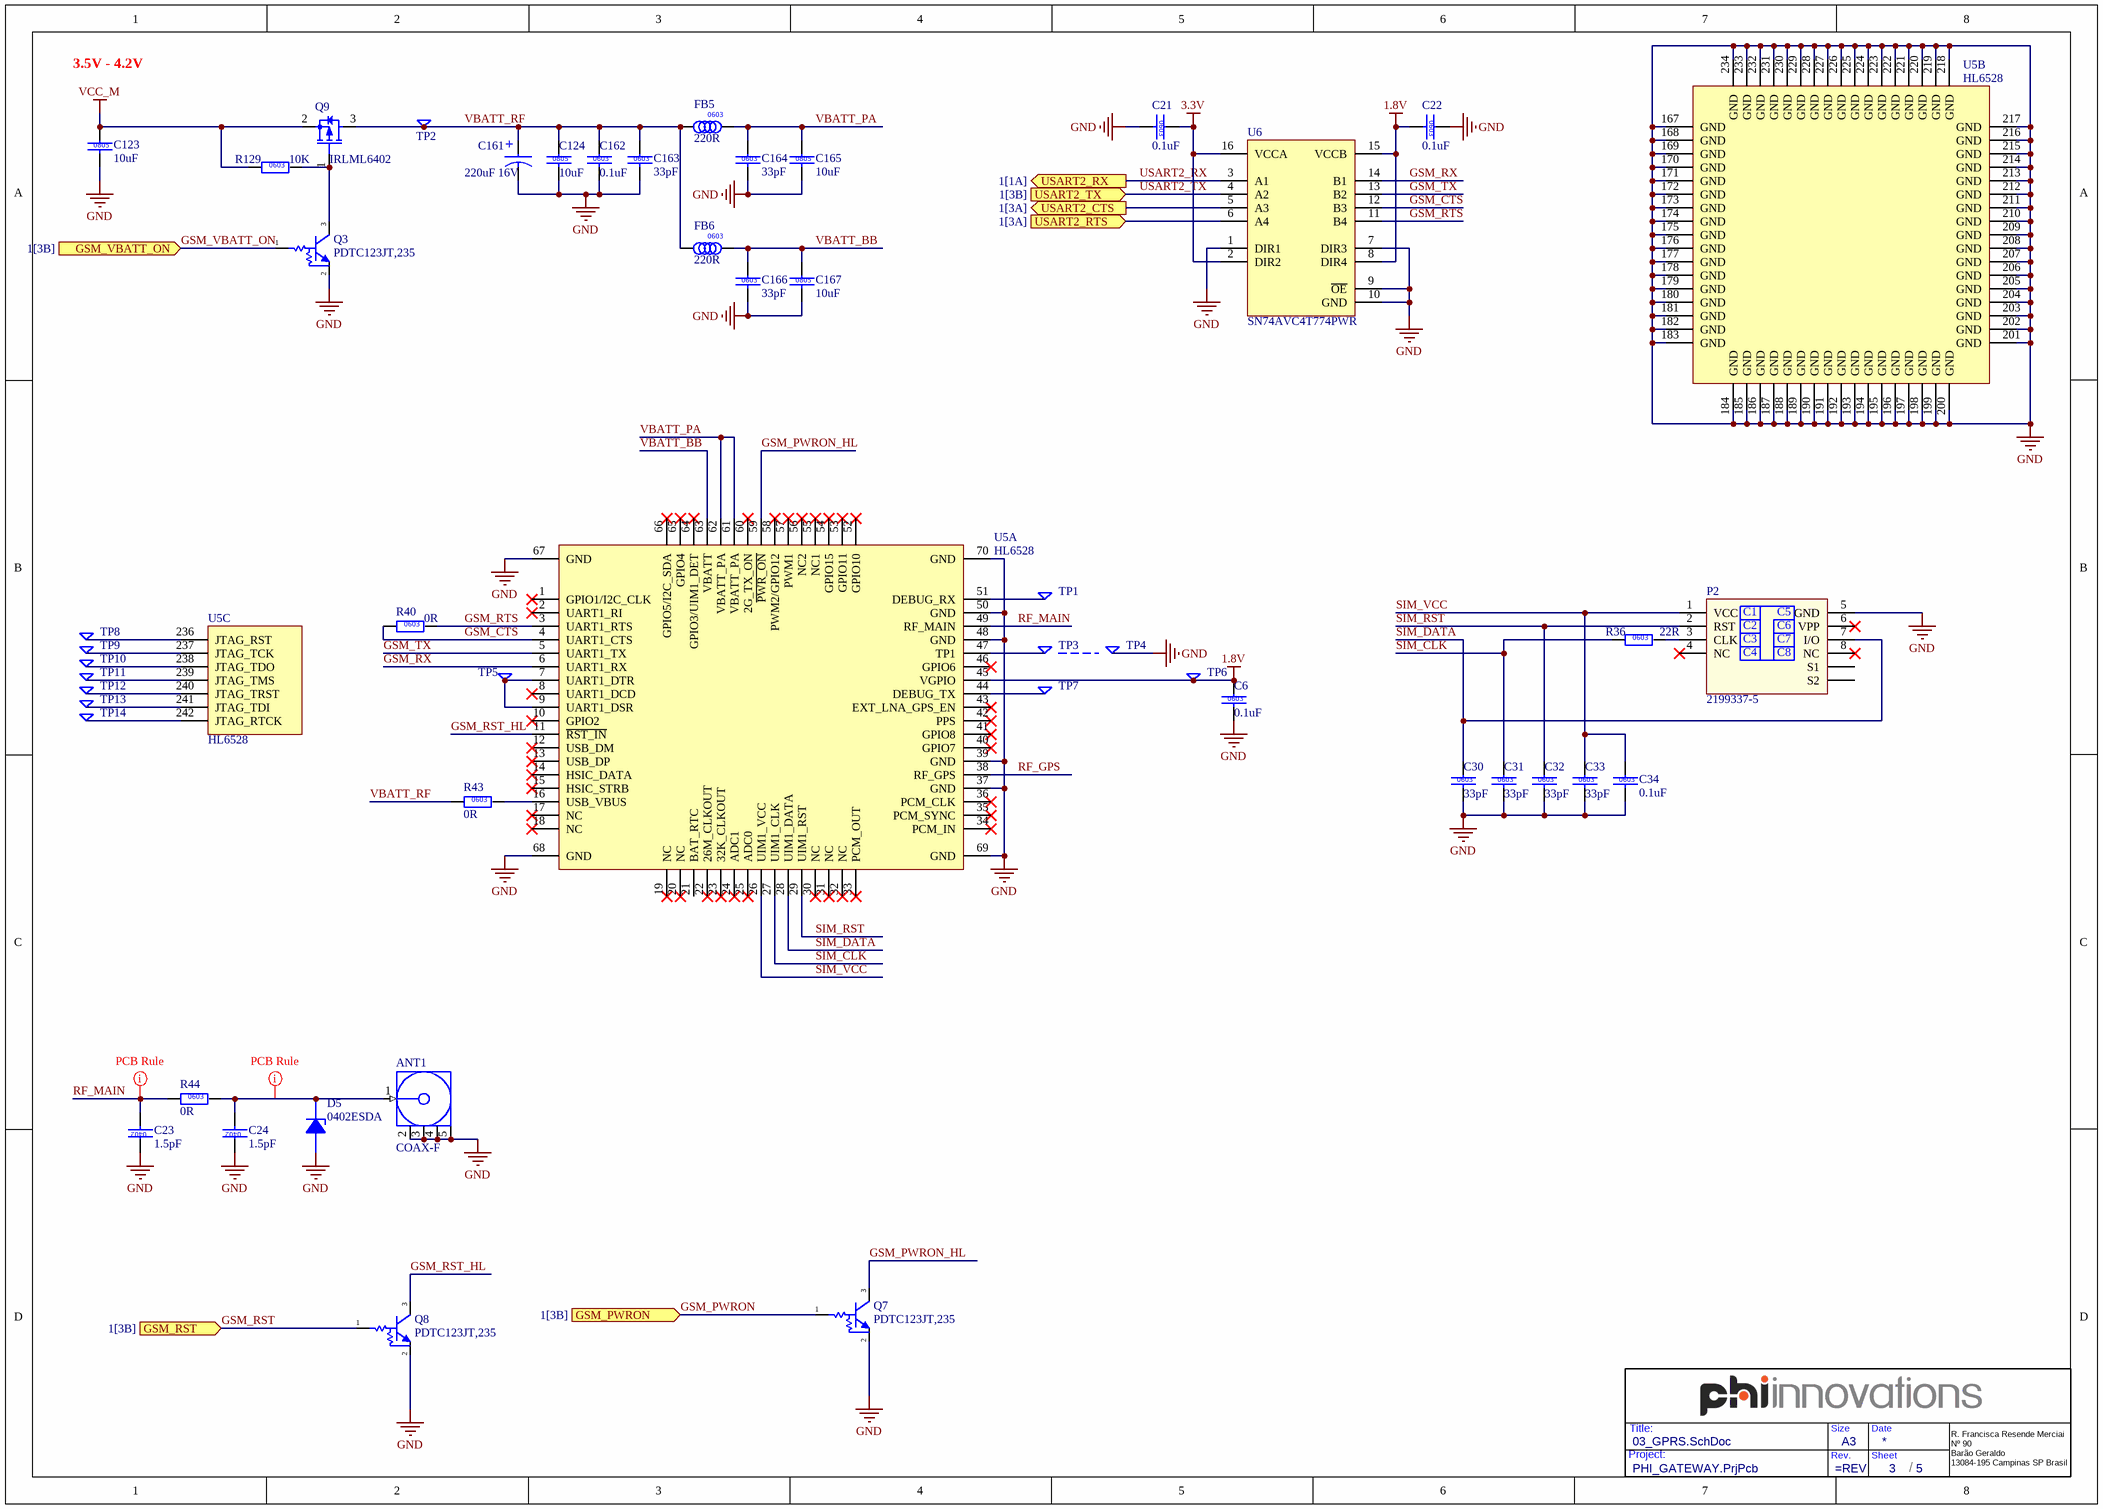
[diagram p2: 03_GPRS.SchDoc]

### Parts
(Parts that share a designator on the sheet are numbered #1, #2 ... from top to bottom, then left to right.)
?#3  (no value)  (graphical)
ANT1  COAX-F  [antena]
C6  0.1uF  [0603C]
C21  0.1uF  [0603C]
C22  0.1uF  [0603C]
C23  1.5pF  [0402C]
C24  1.5pF  [0402C]
C30  33pF  [0603C]
C31  33pF  [0603C]
C32  33pF  [0603C]
C33  33pF  [0603C]
C34  0.1uF  [0603C]
C123  10uF  [0805C]
C124  10uF  [0805C]
C161  220uF 16V  [CAP_RADIAL_6X11]
C162  0.1uF  [0603C]
C163  33pF  [0603C]
C164  33pF  [0603C]
C165  10uF  [0805C]
C166  33pF  [0603C]
C167  10uF  [0805C]
D5  0402ESDA  [0402ESD]
FB5  220R  [0603L]
FB6  220R  [0603L]
P2  2199337-5  [SIM_MICRO_2108431-3]
Q3  PDTC123JT,235  [SOT-23-3]
Q7  PDTC123JT,235  [SOT-23-3]
Q8#1  PDTC123JT,235  [SOT-23-3]
Q9  IRLML6402  [SOT-23]
R36  22R  [0603R]
R40  0R  [0603R]
R43  0R  [0603R]
R44  0R  [0603R]
R129  10K  [0603R]
TP1  TP  [TP]  (value not drawn)  (no BOM)
TP2  TP  [TP]  (value not drawn)  (no BOM)
TP3  TP  [TP]  (value not drawn)  (no BOM)
TP4  TP  [TP]  (value not drawn)  (no BOM)
TP5  TP  [TP]  (value not drawn)  (no BOM)
TP6  TP  [TP]  (value not drawn)  (no BOM)
TP7  TP  [TP]  (value not drawn)  (no BOM)
TP8  TP  [TP]  (value not drawn)  (no BOM)
TP9  TP  [TP]  (value not drawn)  (no BOM)
TP10  TP  [TP]  (value not drawn)  (no BOM)
TP11  TP  [TP]  (value not drawn)  (no BOM)
TP12  TP  [TP]  (value not drawn)  (no BOM)
TP13  TP  [TP]  (value not drawn)  (no BOM)
TP14  TP  [TP]  (value not drawn)  (no BOM)
U5  HL6528  [3G_HL8549]  (parts A,B,C of 3)
U6  SN74AVC4T774PWR  [TSSOP16]

### Ports
GSM_PWRON (in, see 1[3B]), GSM_RST (in, see 1[3B]), GSM_VBATT_ON (in, see 1[3B]), USART2_CTS (out, see 1[3A]), USART2_RTS (in, see 1[3A]), USART2_RX (out, see 1[1A]), USART2_TX (in, see 1[3B])

### Nets
1.8V: C6.1 C22.2 TP6.1 U5.45(VGPIO) U6.8(DIR4) U6.15(VCCB)
3.3V: C21.1 U6.2(DIR2) U6.16(VCCA)
GND: ANT1.2(GND) ANT1.3(GND) ANT1.4(GND) ANT1.5(GND) C6.2 C21.2 C22.1 C23.1 C24.1 C30.2 C31.2 C32.2 C33.2 C34.2 C123.2 C124.2 C161.2 C162.2 C163.2 C164.2 C165.2 C166.2 C167.2 D5.2(A) P2.5(GND) Q3.2(E) Q7.2(E) Q8#1.2(E) TP4.1 U5.37(GND) U5.39(GND) U5.48(GND) U5.50(GND) U5.67(GND) U5.68(GND) U5.69(GND) U5.70(GND) U5.167(GND) U5.168(GND) U5.169(GND) U5.170(GND) U5.171(GND) U5.172(GND) U5.173(GND) U5.174(GND) U5.175(GND) U5.176(GND) U5.177(GND) U5.178(GND) U5.179(GND) U5.180(GND) U5.181(GND) U5.182(GND) U5.183(GND) U5.184(GND) U5.185(GND) U5.186(GND) U5.187(GND) U5.188(GND) U5.189(GND) U5.190(GND) U5.191(GND) U5.192(GND) U5.193(GND) U5.194(GND) U5.195(GND) U5.196(GND) U5.197(GND) U5.198(GND) U5.199(GND) U5.200(GND) U5.201(GND) U5.202(GND) U5.203(GND) U5.204(GND) U5.205(GND) U5.206(GND) U5.207(GND) U5.208(GND) U5.209(GND) U5.210(GND) U5.211(GND) U5.212(GND) U5.213(GND) U5.214(GND) U5.215(GND) U5.216(GND) U5.217(GND) U5.218(GND) U5.219(GND) U5.220(GND) U5.221(GND) U5.222(GND) U5.223(GND) U5.224(GND) U5.225(GND) U5.226(GND) U5.227(GND) U5.228(GND) U5.229(GND) U5.230(GND) U5.231(GND) U5.232(GND) U5.233(GND) U5.234(GND) U6.1(DIR1) U6.7(DIR3) U6.9(~{OE}) U6.10(GND)
VCC_M: C123.1 Q9.2(S) R129.1
GSM_CTS: R40.1 U5.4(UART1_CTS) U6.12(B3)
GSM_PWRON: Q7.1(B) ; port GSM_PWRON
GSM_PWRON_HL: Q7.3(C) U5.59(~{PWR_ON})
GSM_RST: Q8#1.1(B) ; port GSM_RST
GSM_RST_HL: Q8#1.3(C) U5.11(~{RST_IN})
GSM_RTS: R40.2 U5.3(UART1_RTS) U6.11(B4)
GSM_RX: U5.6(UART1_RX) U6.14(B1)
GSM_TX: U5.5(UART1_TX) U6.13(B2)
GSM_VBATT_ON: Q3.1(B) ; port GSM_VBATT_ON
RF_GPS: U5.38(RF_GPS)
RF_MAIN: C23.2 R44.1 U5.49(RF_MAIN)
SIM_CLK: C31.1 R36.1 U5.27(UIM1_CLK)
SIM_DATA: C30.1 P2.7(I/O) U5.28(UIM1_DATA)
SIM_RST: C32.1 P2.2(RST) U5.29(UIM1_RST)
SIM_VCC: C33.1 C34.1 P2.1(VCC) U5.26(UIM1_VCC)
USART2_RX: U6.3(A1) ; port USART2_RX
USART2_TX: U6.4(A2) ; port USART2_TX
VBATT_BB: C166.1 C167.1 FB6.2 U5.63(VBATT)
VBATT_PA: C164.1 C165.1 FB5.2 U5.61(VBATT_PA) U5.62(VBATT_PA)
VBATT_RF: C124.1 C161.1 C162.1 C163.1 FB5.1 FB6.1 Q9.3(D) R43.1 TP2.1
NetANT1_1: ANT1.1(Signal) C24.2 D5.1(K) R44.2
NetP2_3: P2.3(CLK) R36.2
NetQ3_3: Q3.3(C) Q9.1(G) R129.2
NetR34_1: U6.5(A3) ; port USART2_CTS
NetR39_2: U6.6(A4) ; port USART2_RTS
NetR43_2: R43.2 U5.16(USB_VBUS)
NetTP1_1: TP1.1 U5.51(DEBUG_RX)
NetTP3_1: TP3.1 U5.47(TP1)
NetTP5_1: TP5.1 U5.7(UART1_DTR) U5.9(UART1_DSR)
NetTP7_1: TP7.1 U5.44(DEBUG_TX)
NetTP8_1: TP8.1 U5.236(JTAG_RST)
NetTP9_1: TP9.1 U5.237(JTAG_TCK)
NetTP10_1: TP10.1 U5.238(JTAG_TDO)
NetTP11_1: TP11.1 U5.239(JTAG_TMS)
NetTP12_1: TP12.1 U5.240(JTAG_TRST)
NetTP13_1: TP13.1 U5.241(JTAG_TDI)
NetTP14_1: TP14.1 U5.242(JTAG_RTCK)

Not connected (* = marked no-connect by the designer): P2 4(NC)* 6(VPP)* 8(NC)* S1 S2; U5 1(GPIO1/I2C_CLK)* 2(UART1_RI)* 8(UART1_DCD)* 10(GPIO2)* 12(USB_DM)* 13(USB_DP)* 14(HSIC_DATA)* 15(HSIC_STRB)* 17(NC)* 18(NC)* 19(NC)* 20(NC)* 21(BAT_RTC) 22(26M_CLKOUT)* 23(32K_CLKOUT)* 24(ADC1)* 25(ADC0)* 30(NC)* 31(NC)* 32(NC)* 33(PCM_OUT)* 34(PCM_IN)* 35(PCM_SYNC)* 36(PCM_CLK)* 40(GPIO7)* 41(GPIO8)* 42(PPS)* 43(EXT_LNA_GPS_EN)* 46(GPIO6)* 52(GPIO10)* 53(GPIO11)* 54(GPIO15)* 55(NC1)* 56(NC2)* 57(PWM1)* 58(PWM2/GPIO12)* 60(2G_TX_ON)* 64(GPIO3/UIM1_DET)* 65(GPIO4)* 66(GPIO5/I2C_SDA)*

### Layout directives
rule Clearance Constraint [Clearance = 0.254mm]; rule Width Constraint [Pref Width = 0.35mm    Min Width = 0.35mm    Max Width = 0.35mm]: NetANT1_1, RF_MAIN

### Notes on the sheet
- 3.5V - 4.2V
- Project:
- Title:
- Rev.
- Size
- Sheet
- Date
- /
- R. Francisca Resende Merciai
  Nº 90
  Barão Geraldo
  13084-195 Campinas SP Brasil
- (in symbol PHI100.0.0603.000R.001.1/10W) 0603
- (in symbol PHI101.0.0603.010K.001.1/10W) 0603
- (in symbol PHI201.0.0402.001p5.020.050V.C0G) 0402
- (in symbol PHI201.0.0603.000u1.005.050V.X7R) 0603
- (in symbol PHI201.0.0603.0033p.010.050V.C0G) 0603
- (in symbol PHI201.0.0805.0010u.010.010V.X5R) 0805
- (in symbol PHI202.0.000C.0220u.020.16V.XXX) +
- (in symbol PHI350.0.0603.0220R.XXX.0002A.050mOHM) 0603
- (in symbol RES0603) 0603
- (in symbol SIM_Connector) C1; C5; C2; C6; C3; C7; C4; C8

### Library data of the parts
?#3 = Title_Block3
ANT1 = COAX-F: CONN SMA JACK R/A 50 OHM PCB; Manufacturer: TE Connectivity AMP Connectors; Part Number: 5-1814400-1; SCH Info: 2G/3G; Supplier 1: Digi-Key; Supplier Part Number 1: A97593-ND; Fabricante 1: TE Connectivity AMP Connectors; Partnumber fabricante 1: 5-1814400-1; P Description: CONN SMA JACK R/A 50 OHM PCB; PN distribuidor 1 / Fab 1: A97593-ND; Value: JACK R/A 50 OHM
C6 C21 C22 C162 = PHI201.0.0603.000u1.005.050V.X7R: CAP0603; Partnumber fabricante 1: 06035C104JAT2A; Fabricante 1: AVX Corporation; P Description: Capacitor ceramico 0603 0.1uF 20% 50V X7R; SCH Info: 2G/3G; Partnumber PHI: PHI201.0.0603.000u1.005.050V.X7R; Datasheet fabricante 1: http://datasheets.avx.com/X7RDielectric.pdf; Distribuidor 1: Digi Key; PN distribuidor 1 / Fab 1: 478-5778-1-ND; Distribuidor 2: Mouser; Value: 0.1uF
C23 C24 = PHI201.0.0402.001p5.020.050V.C0G: CAP0402; Partnumber fabricante 1: GRM1555C1H1R5CA01D; Fabricante 1: Murata Electronics North America; P Description: Capacitor ceramico 0402 2.2pF 5% 50V C0G; SCH Info: 2G/3G; Partnumber PHI: PHI201.0.0402.001p5.020.050V.C0G; Datasheet fabricante 1: http://search.murata.co.jp/Ceramy/image/img/A01X/partnumbering_e_01.pdf; Partnumber fabricante 2: XXXX; Distribuidor 1: Digi Key; PN distribuidor 1 / Fab 1: 490-5891-1-ND; Distribuidor 2: Mouser; Value: 1.5pF
C30-C33 = PHI201.0.0603.0033p.010.050V.C0G: CAP0603; Partnumber fabricante 1: GRM1885C1H330JA01D; Fabricante 1: Murata Electronics North America; P Description: Capacitor ceramico 0603 33pF 10% 50V C0G; Partnumber PHI: PHI201.0.0603.0033p.010.050V.C0G; Datasheet fabricante 1: http://search.murata.co.jp/Ceramy/image/img/A01X/partnumbering_e_01.pdf; Distribuidor 1: Digi Key; PN distribuidor 1 / Fab 1: 490-1415-1-ND; Distribuidor 2: Mouser; Value: 33pF
C34 = PHI201.0.0603.000u1.005.050V.X7R: as C149 on sheet 01_CPU; Partnumber PHI: PHI201.0.0603.000u1.005.050V.X7R; Datasheet fabricante 1: http://datasheets.avx.com/X7RDielectric.pdf; Distribuidor 1: Digi Key; PN distribuidor 1 / Fab 1: 478-5778-1-ND; Distribuidor 2: Mouser; Value: 0.1uF
C123 C124 C165 C167 = PHI201.0.0805.0010u.010.010V.X5R: CAP0805; Partnumber fabricante 1: 0805ZD106MAT2A; Fabricante 1: AVX Corporation; P Description: Capacitor ceramico 0805 10uF 10% 10V X5R; Partnumber PHI: PHI201.0.0805.0010u.010.010V.X5R; Datasheet fabricante 1: http://datasheets.avx.com/cx5r.pdf; Distribuidor 1: Digi Key; PN distribuidor 1 / Fab 1: 478-5326-1-ND; Distribuidor 2: Mouser; Value: 10uF
C161 = PHI202.0.000C.0220u.020.16V.XXX: CAP_AL_EL_13mm; Partnumber fabricante 1: B41827A4227M007; Fabricante 1: EPCOS; P Description: CAP ALUM 220UF 20% 16V RADIAL; Partnumber PHI: PHI202.0.000C.0220u.020.16V.XXX; Datasheet fabricante 1: https://media.digikey.com/pdf/Data%20Sheets/Epcos%20PDFs/B41827_B43827.pdf; Distribuidor 1: Digi Key; PN distribuidor 1 / Fab 1: B41827A4227M007; PN distribuidor 1 / Fab 2: B41827A4227M-ND; Distribuidor 2: Mouser; Value: 220uF 16V
C163 C164 C166 = PHI201.0.0603.0033p.010.050V.C0G: CAP0603; Partnumber fabricante 1: GRM1885C1H330JA01D; Fabricante 1: Murata Electronics North America; P Description: Capacitor ceramico 0603 33pF 10% 50V C0G; SCH Info: 2G/3G; Partnumber PHI: PHI201.0.0603.0033p.010.050V.C0G; Datasheet fabricante 1: http://search.murata.co.jp/Ceramy/image/img/A01X/partnumbering_e_01.pdf; Distribuidor 1: Digi Key; PN distribuidor 1 / Fab 1: 490-1415-1-ND; Distribuidor 2: Mouser; Value: 33pF
D5 = PHI430.0.0402ESDA-MLP1: Fabricante 1: Eaton; P Description: SUPPRESSOR ESD 30VDC 0402 HFREE; SCH Info: 2G/3G; Partnumber PHI: PHI430.0.0402ESDA-MLP1; Partnumber fabricante 1: 0402ESDA-MLP1; Datasheet fabricante 1: http://www.cooperindustries.com/content/dam/public/bussmann/Electronics/Resources/product-datasheets/Bus_Elx_DS_0402ESDA_MLP1_ESD_Suppressor.pdf; Distribuidor 1: Digi Key; PN distribuidor 1 / Fab 1: 283-2964-1-ND; Distribuidor 2: Mouser; Value: 0402ESDA
FB5 FB6 = PHI350.0.0603.0220R.XXX.0002A.050mOHM: FB0603; Partnumber fabricante 1: BLM18EG221SN1D; Fabricante 1: Murata Electronics North America; P Description: Ferrite Bead Chip 0603 220OHM 2A 50mOHM; SCH Info: 2G/3G; Partnumber PHI: PHI350.0.0603.0220R.XXX.0002A.050mOHM; Datasheet fabricante 1: http://search.murata.co.jp/Ceramy/image/img/PDF/ENG/L0110S0101BLM18E.pdf; Distribuidor 1: Digi Key; PN distribuidor 1 / Fab 1: 490-3992-1-ND; Distribuidor 2: Mouser; Value: 220R
P2 = SIM_Connector: ASS'Y FOR MICRO SIM H1.24 8POS; Manufacturer: TE Connectivity AMP Connectors; P Description: CONN MICRO SIM CARD PUSH-PULL; Supplier 1: Digi-Key; Distribuidor 1: Digi-Key; Fabricante 1: TE Connectivity AMP Connectors; Partnumber fabricante 1: 2199337-5; PN distribuidor 1 / Fab 1: A125065CT-ND; Value: 2199337-5
Q3 = PHI530.0.PDTC123JT,235: as Q1 on sheet 01_CPU; Partnumber PHI: PHI530.0.PDTC123JT,235; Partnumber fabricante 1: PDTC123JT,235; Datasheet fabricante 1: http://www.nxp.com/documents/data_sheet/PDTC123J_SER.pdf; Distribuidor 1: Digi Key; PN distribuidor 1 / Fab 1: 568-2154-1-ND; Distribuidor 2: Mouser; Value: PDTC123JT,235
Q7 Q8#1 = PHI530.0.PDTC123JT,235: BJT_PB_NPN_SOT23-3; Fabricante 1: NXP Semiconductors; P Description: TRANS PREBIAS NPN 250MW TO236AB; SCH Info: 2G/3G; Partnumber PHI: PHI530.0.PDTC123JT,235; Partnumber fabricante 1: PDTC123JT,235; Datasheet fabricante 1: http://www.nxp.com/documents/data_sheet/PDTC123J_SER.pdf; Distribuidor 1: Digi Key; PN distribuidor 1 / Fab 1: 568-2154-1-ND; Distribuidor 2: Mouser; Value: PDTC123JT,235
Q9 = PHI500.0.IRLML6402TRPBF: P-Channel MOSFET; Fabricante 1: Infineon Technologies Americas Corp; P Description: MOSFET P CH SOT-23 20V 3.7A; SCH Info: GERAL; Partnumber PHI: PHI500.0.IRLML6402TRPBF; Partnumber fabricante 1: IRLML6402TRPBF; Datasheet fabricante 1: http://www.irf.com/product-info/datasheets/data/irlml6402pbf.pdf; Distribuidor 1: Digi Key; PN distribuidor 1 / Fab 1: IRLML6402PBFCT-ND; Distribuidor 2: Mouser; Value: IRLML6402
R36 = RES0603: Part Number: RES SMD 22 OHM 1% 1/10W 0603; Partnumber fabricante 1: RC0603FR-0722RL; Partnumber PHI: PHI100.0.0603.022R.001.1/10W; Fabricante 1: Yageo; P Description: Resistor SMD 0603 22R 1% 1/10W; Fabricante 2: Stackpole Electronics Inc; Supplier 1: Digi-Key; Supplier Part Number 1: 311-22.0HRCT-ND; Datasheet fabricante 1: http://www.yageo.com/NewPortal/yageodocoutput?fileName=/pdf/R-Chip/PYu-RC_Group_51_RoHS_L_3.pdf; Distribuidor 1: Digi Key; Distribuidor 2: Mouser; PN distribuidor 1 / Fab 1: 311-22.0HRCT-ND; Value: 22R; Datasheet fabricante 2: http://www.seielect.com/Catalog/SEI-RMCF_RMCP.pdf; Partnumber fabricante 2: RMCF0603FT22R0; PN distribuidor 1 / Fab 2: RMCF0603FT22R0CT-ND
R40 R43 R44 = PHI100.0.0603.000R.001.1/10W: RES0603; Partnumber fabricante 1: RC0603JR-070RL; Fabricante 1: Yageo; Fabricante 2: Panasonic Electronic Components; P Description: Resistor SMD 0603 0R JUMPER 1/10W; SCH Info: 2G/3G; Partnumber PHI: PHI100.0.0603.000R.001.1/10W; Datasheet fabricante 1: http://www.yageo.com/NewPortal/yageodocoutput?fileName=/pdf/R-Chip/PYu-RC_Group_51_RoHS_L_3.pdf; Partnumber fabricante 2: ERJ-3GEY0R00V; Datasheet fabricante 2: http://industrial.panasonic.com/www-cgi/jvcr13pz.cgi?E+PZ+3+AOA0001+ERJ3GEY0R00V+7+WW; Distribuidor 1: Digi Key; PN distribuidor 1 / Fab 1: 311-0.0GRCT-ND; PN distribuidor 1 / Fab 2: P0.0GTR-ND; Distribuidor 2: Mouser; Value: 0R
R129 = PHI101.0.0603.010K.001.1/10W: RES0603; Partnumber fabricante 1: RC0603FR-0710KL; Fabricante 1: Yageo; Fabricante 2: Stackpole Electronics Inc; P Description: Resistor SMD 0603 10K 1% 1/08W; SCH Info: 2G/3G; Partnumber PHI: PHI101.0.0603.010K.001.1/10W; Datasheet fabricante 1: http://www.yageo.com/documents/recent/PYu-RC_Group_51_RoHS_L_04.pdf; Partnumber fabricante 2: RNCP0603FTD10K0; Datasheet fabricante 2: http://www.seielect.com/catalog/SEI-RNCP.pdf; Distribuidor 1: Digi Key; PN distribuidor 1 / Fab 1: 311-10.0KHRCT-ND; PN distribuidor 1 / Fab 2: RMCF0603FT10K0CT-ND; Distribuidor 2: Mouser; Value: 10K
TP1-TP14 = TP: Test Point; PCB INFO: DNP; SCH Info: 2G/3G
U5 = PHI800.0.HL6528: Partnumber fabricante 1: HL6528-2.8VBR; Fabricante 1: Sierra Wireless; P Description: GSM MODEM GPRS; SCH Info: 2G/3G; Partnumber PHI: PHI800.0.HL6528; Datasheet fabricante 1: http://source.sierrawireless.com/devices/hl-series/hl6528/; Value: HL6528
U6 = PHI800.0.SN74AVC4T774PWR: IC BUS TRANSCVR 4BIT DL; Fabricante 1: Texas Instruments; P Description: IC BUS TRANSCVR 4BIT DL 16TSSOP; Value: MAX3232-TSSOP; SCH Info: 2G/3G; Partnumber PHI: PHI800.0.SN74AVC4T774PWR; Partnumber fabricante 1: SN74AVC4T774PWR; Datasheet fabricante 1: http://www.ti.com/lit/ds/symlink/sn74avc4t774.pdf; Distribuidor 1: Digi Key; PN distribuidor 1 / Fab 1: 296-24739-1-ND; Distribuidor 2: Mouser